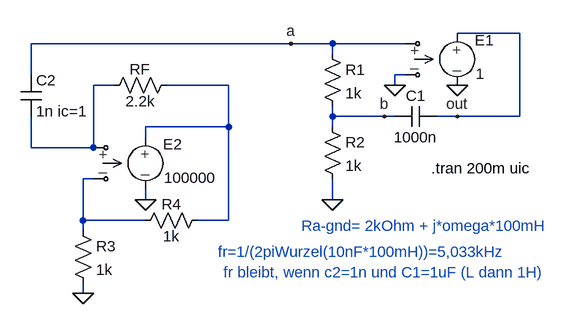
[diagram p0: schematic L-ersatz-q1.asc]
L-ersatz-q1.asc, the LTspice schematic file:
Version 4
SHEET 1 1072 680
WIRE 480 32 384 32
WIRE 128 48 -272 48
WIRE 192 48 128 48
WIRE 304 48 192 48
WIRE 192 64 192 48
WIRE -272 96 -272 48
WIRE 304 96 288 96
WIRE -144 112 -176 112
WIRE 32 112 -64 112
WIRE 288 112 288 96
WIRE 192 160 192 144
WIRE 272 160 192 160
WIRE 288 160 272 160
WIRE 384 160 352 160
WIRE 480 160 480 32
WIRE 480 160 384 160
WIRE 32 176 32 112
WIRE 32 176 -96 176
WIRE 192 176 192 160
WIRE -96 192 -96 176
WIRE -272 208 -272 160
WIRE -176 208 -176 112
WIRE -176 208 -272 208
WIRE -176 256 -192 256
WIRE -96 288 -96 272
WIRE 192 288 192 256
WIRE -192 320 -192 256
WIRE -96 320 -192 320
WIRE 32 320 32 176
WIRE 32 320 -16 320
WIRE -192 336 -192 320
WIRE -192 432 -192 416
FLAG 192 288 0
FLAG 128 48 a
FLAG 272 160 b
FLAG 384 160 out
FLAG 288 112 0
FLAG 384 112 0
FLAG -192 432 0
FLAG -96 288 0
SYMBOL res 176 48 R0
SYMATTR InstName R1
SYMATTR Value 1k
SYMBOL res 176 160 R0
SYMATTR InstName R2
SYMATTR Value 1k
SYMBOL cap 352 144 R90
WINDOW 0 0 32 VBottom 2
WINDOW 3 32 32 VTop 2
SYMATTR InstName C1
SYMATTR Value 1000n
SYMBOL cap -288 96 R0
SYMATTR InstName C2
SYMATTR Value 1n ic=1
SYMBOL crtl-V-V 384 16 R0
SYMATTR InstName E1
SYMATTR Value 1
SYMBOL crtl-V-V -96 176 R0
SYMATTR InstName E2
SYMATTR Value 100000
SYMBOL res -208 320 R0
SYMATTR InstName R3
SYMATTR Value 1k
SYMBOL res 0 304 R90
WINDOW 0 7 56 VBottom 2
WINDOW 3 25 56 VTop 2
SYMATTR InstName R4
SYMATTR Value 1k
SYMBOL res -48 96 R90
WINDOW 0 7 56 VBottom 2
WINDOW 3 25 56 VTop 2
SYMATTR InstName RF
SYMATTR Value 2.2k
TEXT 344 240 Left 2 !.tran 200m uic
TEXT 144 328 Left 2 ;Ra-gnd= 2kOhm + j*omega*100mH
TEXT 16 368 Left 2 ;fr=1/(2piWurzel(10nF*100mH))=5,033kHz
TEXT 24 400 Left 2 ;fr bleibt, wenn c2=1n und C1=1uF (L dann 1H)

The netlist it stands for:
* L-ersatz-q1.asc
R1 a b 1k
R2 b 0 1k
C1 out b 1000n
C2 a N001 1n ic=1
E1 out 0 a 0 1
E2 N002 0 N001 N003 100000
R3 N003 0 1k
R4 N002 N003 1k
RF N002 N001 2.2k
.tran 200m uic
* Ra-gnd= 2kOhm + j*omega*100mH
* fr=1/(2piWurzel(10nF*100mH))=5,033kHz
* fr bleibt, wenn c2=1n und C1=1uF (L dann 1H)
.backanno
.end